# Altium schematic sheet 02_ESP32-C3-WROOM-02.SchDoc
size 420 x 297 mm
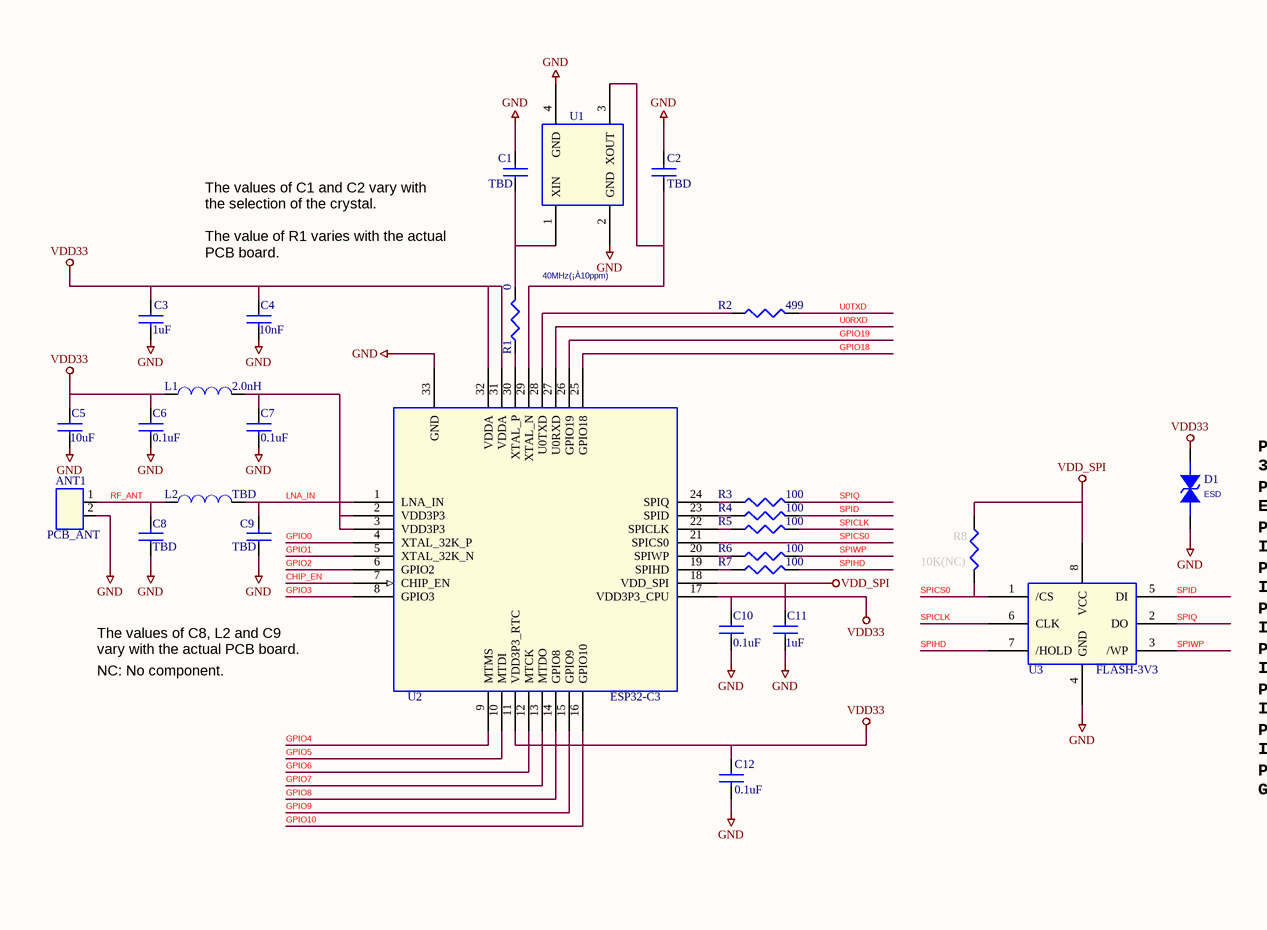
[diagram p0: 02_ESP32-C3-WROOM-02.SchDoc, left]
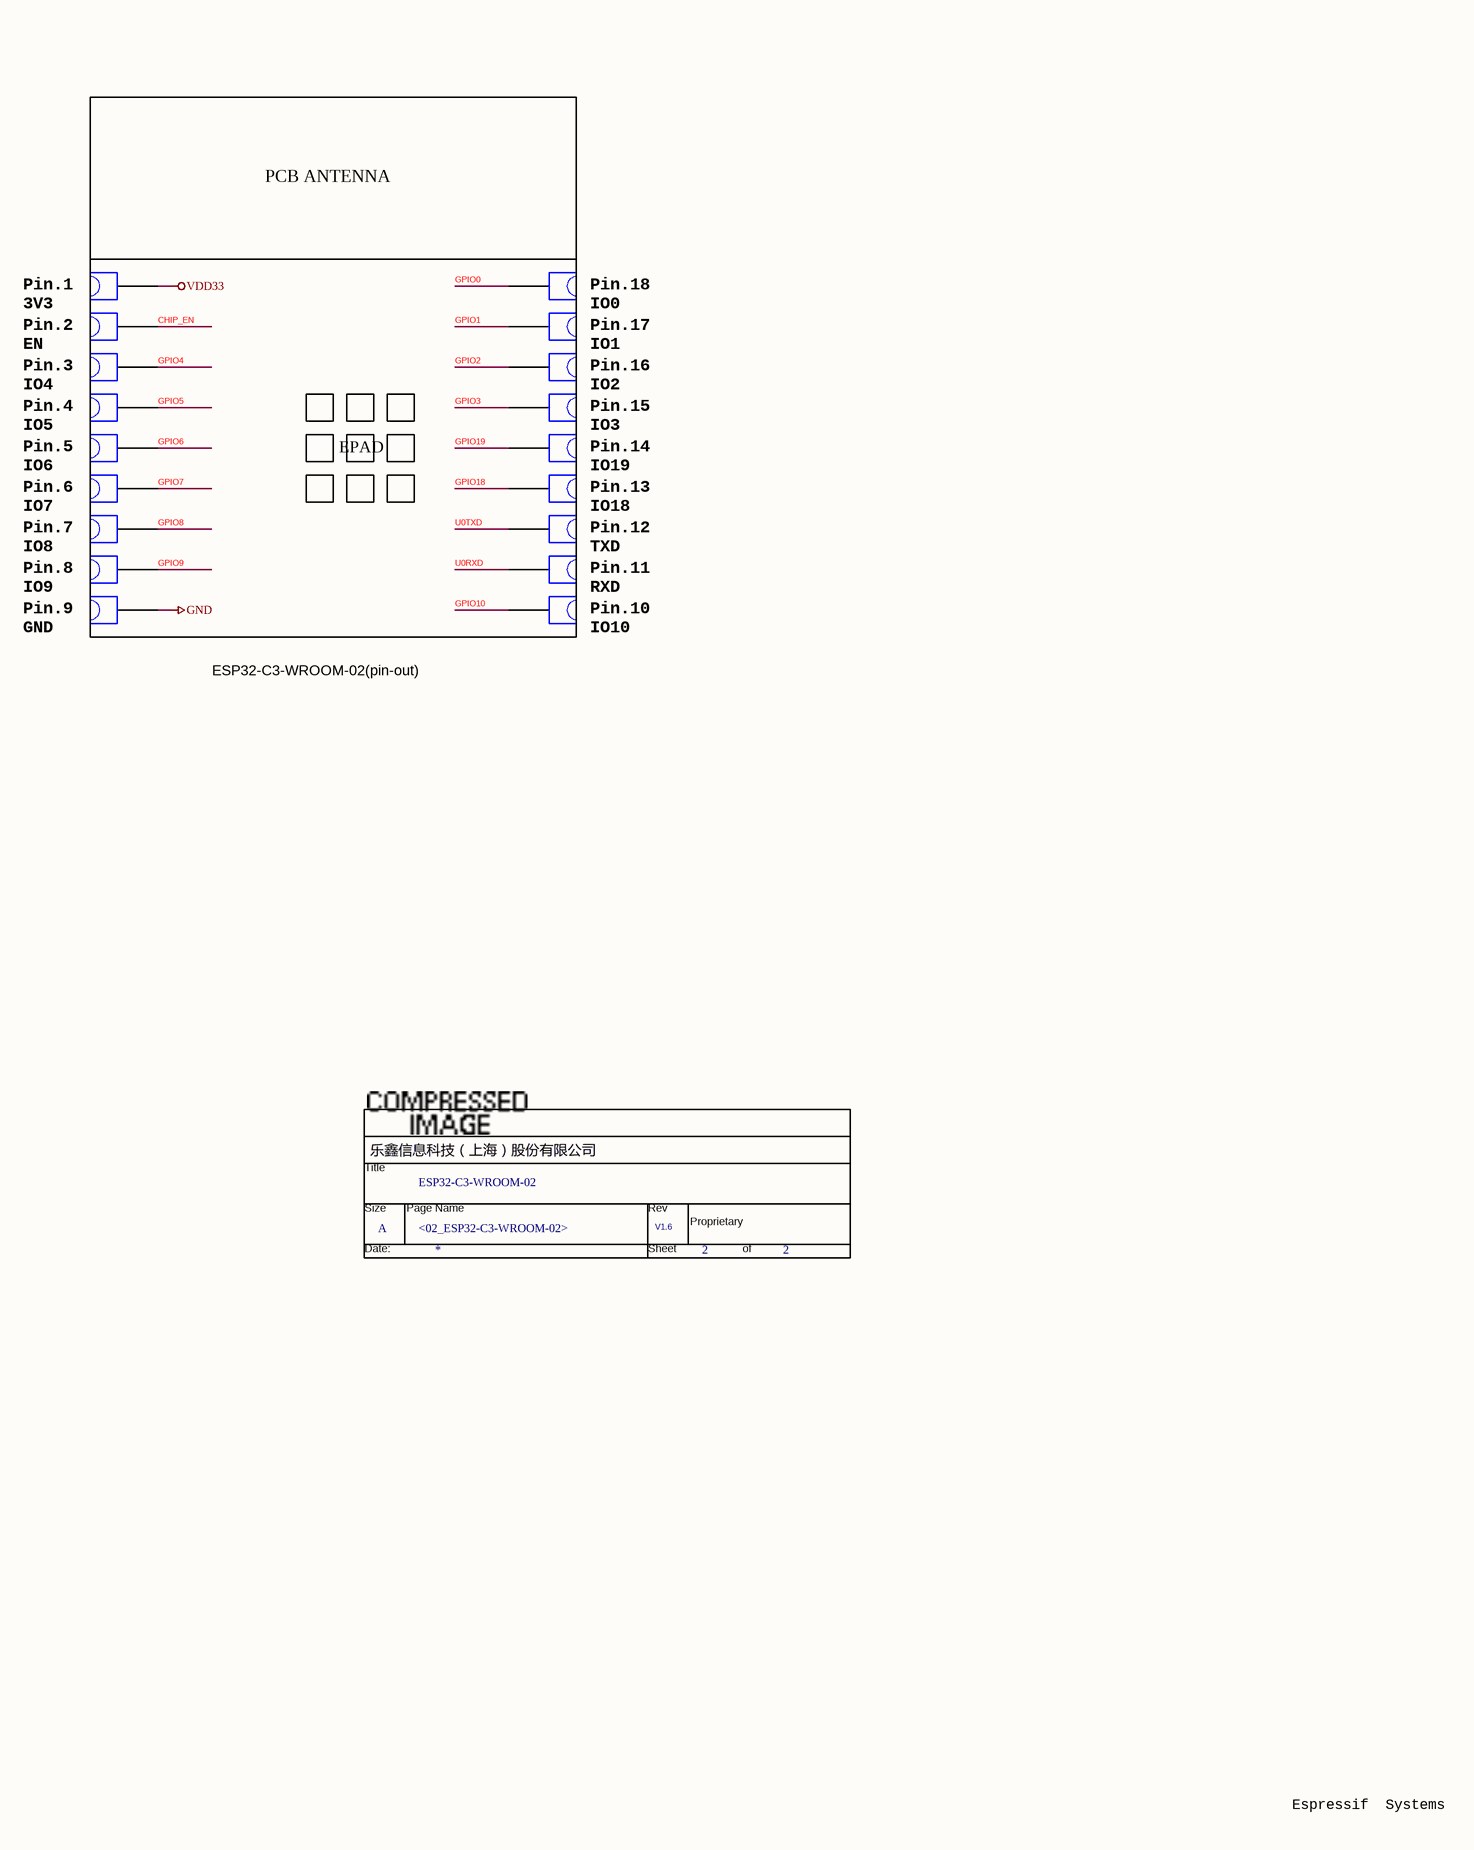
[diagram p1: 02_ESP32-C3-WROOM-02.SchDoc, right]

## Parts
*  Doc: <02_ESP32-C3-WROOM-02>  Title: ESP32-C3-WROOM-02  Page Size: A  Page Number: 2  RevCode: V1.6  (hidden comment: espTitleBlock3)  (graphical)
ANT1  PCB_ANT  [MINI-ANT-TYPEB]
C1  TBD  [C0201]
C2  TBD  [C0201]
C3  1uF  [C0201]
C4  10nF  [C0201]
C5  10uF  [C0402]
C6  0.1uF  [C0201]
C7  0.1uF  [C0201]
C8  TBD  [C0201]
C9  TBD  [C0201]
C10  0.1uF  [C0201]
C11  1uF  [C0201]
C12  0.1uF  [C0201]
D1  ESD  [ESD0402]
J1  CON1  [SPAD_1]  (value not drawn)
J2  CON1  [SPAD_1]  (value not drawn)
J3  CON1  [SPAD_1]  (value not drawn)
J4  CON1  [SPAD_1]  (value not drawn)
J5  CON1  [SPAD_1]  (value not drawn)
J6  CON1  [SPAD_1]  (value not drawn)
J7  CON1  [SPAD_1]  (value not drawn)
J8  CON1  [SPAD_1]  (value not drawn)
J9  CON1  [SPAD_1]  (value not drawn)
J10  CON1  [SPAD_1]  (value not drawn)
J11  CON1  [SPAD_1]  (value not drawn)
J12  CON1  [SPAD_1]  (value not drawn)
J13  CON1  [SPAD_1]  (value not drawn)
J14  CON1  [SPAD_1]  (value not drawn)
J15  CON1  [SPAD_1]  (value not drawn)
J16  CON1  [SPAD_1]  (value not drawn)
J17  CON1  [SPAD_1]  (value not drawn)
J18  CON1  [SPAD_1]  (value not drawn)
L1  2.0nH  [L0201]
L2  TBD  [L0201]
R1  0  [R0201]
R2  499  [R0201]
R3  100  [R0201]
R4  100  [R0201]
R5  100  [R0201]
R6  100  [R0201]
R7  100  [R0201]
R8  10K(NC)  [R0201]
U1  40MHz(¡À10ppm)  [XTAL3225]
U2  ESP32-C3  [QFN32_0P5_5_B]
U3  FLASH-3V3  [SOP8_1P27_6P6]

## Blocks framed on the sheet
PCB ANTENNA: J1-J18

## Nets
GND: ANT1.2 C1.2 C2.2 C3.2 C4.2 C5.2 C6.2 C7.2 C8.1 C9.1 C10.2 C11.2 C12.2 D1.2 J9.1 U1.2(GND) U1.4(GND) U2.33(GND) U3.4(GND)
VDD33: C3.1 C4.1 C5.1 C6.1 C10.1 C12.1 D1.1 J1.1 L1.2 U2.11(VDD3P3_RTC) U2.17(VDD3P3_CPU) U2.31(VDDA) U2.32(VDDA)
VDD_SPI: C11.1 R8.2 U2.18(VDD_SPI) U3.8(VCC)
CHIP_EN: J2.1 U2.7(CHIP_EN)
GPIO0: J18.1 U2.4(XTAL_32K_P)
GPIO1: J17.1 U2.5(XTAL_32K_N)
GPIO2: J16.1 U2.6(GPIO2)
GPIO3: J15.1 U2.8(GPIO3)
GPIO4: J3.1 U2.9(MTMS)
GPIO5: J4.1 U2.10(MTDI)
GPIO6: J5.1 U2.12(MTCK)
GPIO7: J6.1 U2.13(MTDO)
GPIO8: J7.1 U2.14(GPIO8)
GPIO9: J8.1 U2.15(GPIO9)
GPIO10: J10.1 U2.16(GPIO10)
GPIO18: J13.1 U2.25(GPIO18)
GPIO19: J14.1 U2.26(GPIO19)
LNA_IN: C9.2 L2.1 U2.1(LNA_IN)
RF_ANT: ANT1.1 C8.2 L2.2
SPICLK: R5.2 U3.6(CLK)
SPICS0: R8.1 U2.21(SPICS0) U3.1(/CS)
SPID: R4.2 U3.5(DI)
SPIHD: R7.2 U3.7(/HOLD)
SPIQ: R3.2 U3.2(DO)
SPIWP: R6.2 U3.3(/WP)
U0RXD: J11.1 U2.27(U0RXD)
U0TXD: J12.1 R2.2
NetC1_1: C1.1 R1.2 U1.1(XIN)
NetC2_1: C2.1 U1.3(XOUT) U2.29(XTAL_N)
NetC7_1: C7.1 L1.1 U2.2(VDD3P3) U2.3(VDD3P3)
NetR1_1: R1.1 U2.30(XTAL_P)
NetR2_1: R2.1 U2.28(U0TXD)
NetR3_1: R3.1 U2.24(SPIQ)
NetR4_1: R4.1 U2.23(SPID)
NetR5_1: R5.1 U2.22(SPICLK)
NetR6_1: R6.1 U2.20(SPIWP)
NetR7_1: R7.1 U2.19(SPIHD)

## Notes on the sheet
- The values of C1 and C2 vary with
  the selection of the crystal.
  The value of R1 varies with the actual
  PCB board.
- Pin.1
  3V3
- Pin.18
  IO0
- Pin.2
  EN
- Pin.17
  IO1
- Pin.3
  IO4
- Pin.4
  IO5
- Pin.16
  IO2
- Pin.15
  IO3
- The values of C8, L2 and C9
  vary with the actual PCB board.
- Pin.5
  IO6
- Pin.6
  IO7
- EPAD
- Pin.13
  IO18
- Pin.14
  IO19
- NC: No component.
- Pin.7
  IO8
- Pin.12
  TXD
- Pin.8
  IO9
- Pin.9
  GND
- Pin.11
  RXD
- Pin.10
  IO10
- ESP32-C3-WROOM-02(pin-out)
- Espressif  Systems
- (in symbol espTitleBlock3) Title; Size; Page Name; Rev; Proprietary; Date:; Sheet; of

## Library data of the parts
* = espTitleBlock3: Page Name: V; Page Create Date: March  8, 1995; Page Count: 2; Page Modify Date: *
C1-C12 = CAP
  C1-C4 C6-C12: PCB Footprint: C0201
  C5: PCB Footprint: C0402
D1 = DIODE BI-DIR TRIG: PCB Footprint: SOD882; Options: ESD
J1-J18 = CON1_3: PCB Footprint: SPAD_1
L1 L2 = Inductor: PCB Footprint: L0201
R1-R8 = RESISTOR_0: PCB Footprint: R0201
U1 = X1_1: PCB Footprint: XTAL3225
U3 = FLASH_3: PCB Footprint: SOP8_1P27_6P6
ANT1 = PCB_ANT: PCB Footprint: MINI-ANT-TYPEB
U2 = ESP32-C3: PCB Footprint: QFN32_0P5_5_B